# Altium schematic sheet Mixer.SchDoc
size 420 x 297 mm; DocumentNumber: Audio output
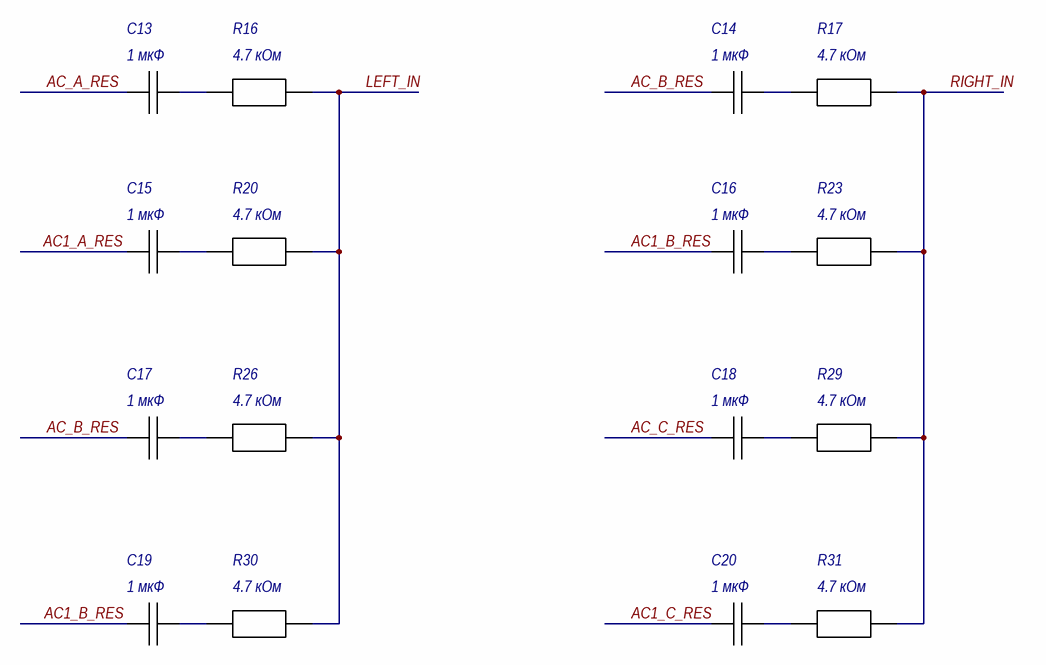
[diagram p0: Mixer.SchDoc]

## Parts
C13  1 мкФ  [C 1206]
C14  1 мкФ  [C 1206]
C15  1 мкФ  [C 1206]
C16  1 мкФ  [C 1206]
C17  1 мкФ  [C 1206]
C18  1 мкФ  [C 1206]
C19  1 мкФ  [C 1206]
C20  1 мкФ  [C 1206]
R16  4.7 кОм  [RES 0805]
R17  4.7 кОм  [RES 0805]
R20  4.7 кОм  [RES 0805]
R23  4.7 кОм  [RES 0805]
R26  4.7 кОм  [RES 0805]
R29  4.7 кОм  [RES 0805]
R30  4.7 кОм  [RES 0805]
R31  4.7 кОм  [RES 0805]

## Nets
AC1_A_RES: C15.1
AC1_B_RES: C16.1 C19.1
AC1_C_RES: C20.1
AC_A_RES: C13.1
AC_B_RES: C14.1 C17.1
AC_C_RES: C18.1
LEFT_IN: R16.2 R20.2 R26.2 R30.2
RIGHT_IN: R17.2 R23.2 R29.2 R31.2
NetC13_2: C13.2 R16.1
NetC14_2: C14.2 R17.1
NetC15_2: C15.2 R20.1
NetC16_2: C16.2 R23.1
NetC17_2: C17.2 R26.1
NetC18_2: C18.2 R29.1
NetC19_2: C19.2 R30.1
NetC20_2: C20.2 R31.1

## Notes on the sheet
- Подп. и дата
- Инв. № дубл.
- Взам. инв. №
- Инв. № подл.
- Лист
- Изм.
- № докум.
- Подп.
- Дата
- Копировал
- Формат А3

## Library data of the parts
C13-C20 = CAP 1206: SMD Capacitor 1206; Manufacturer: /Укажите компанию-производителя/; Tolerance: /Укажите допуск в процентах/; Temperature coefficient: /Формат: ±? ppm/°C/; Type: Конденсатор керамический; TC: /Укажите тип диэлектрика/; Size: 1206; Temperature range: /Формат: -? ... ? °C/
R16 R17 R20 R23 R26 R29-R31 = RES 0805